# EAGLE schematic l_meter (EAGLE 9.2.2)
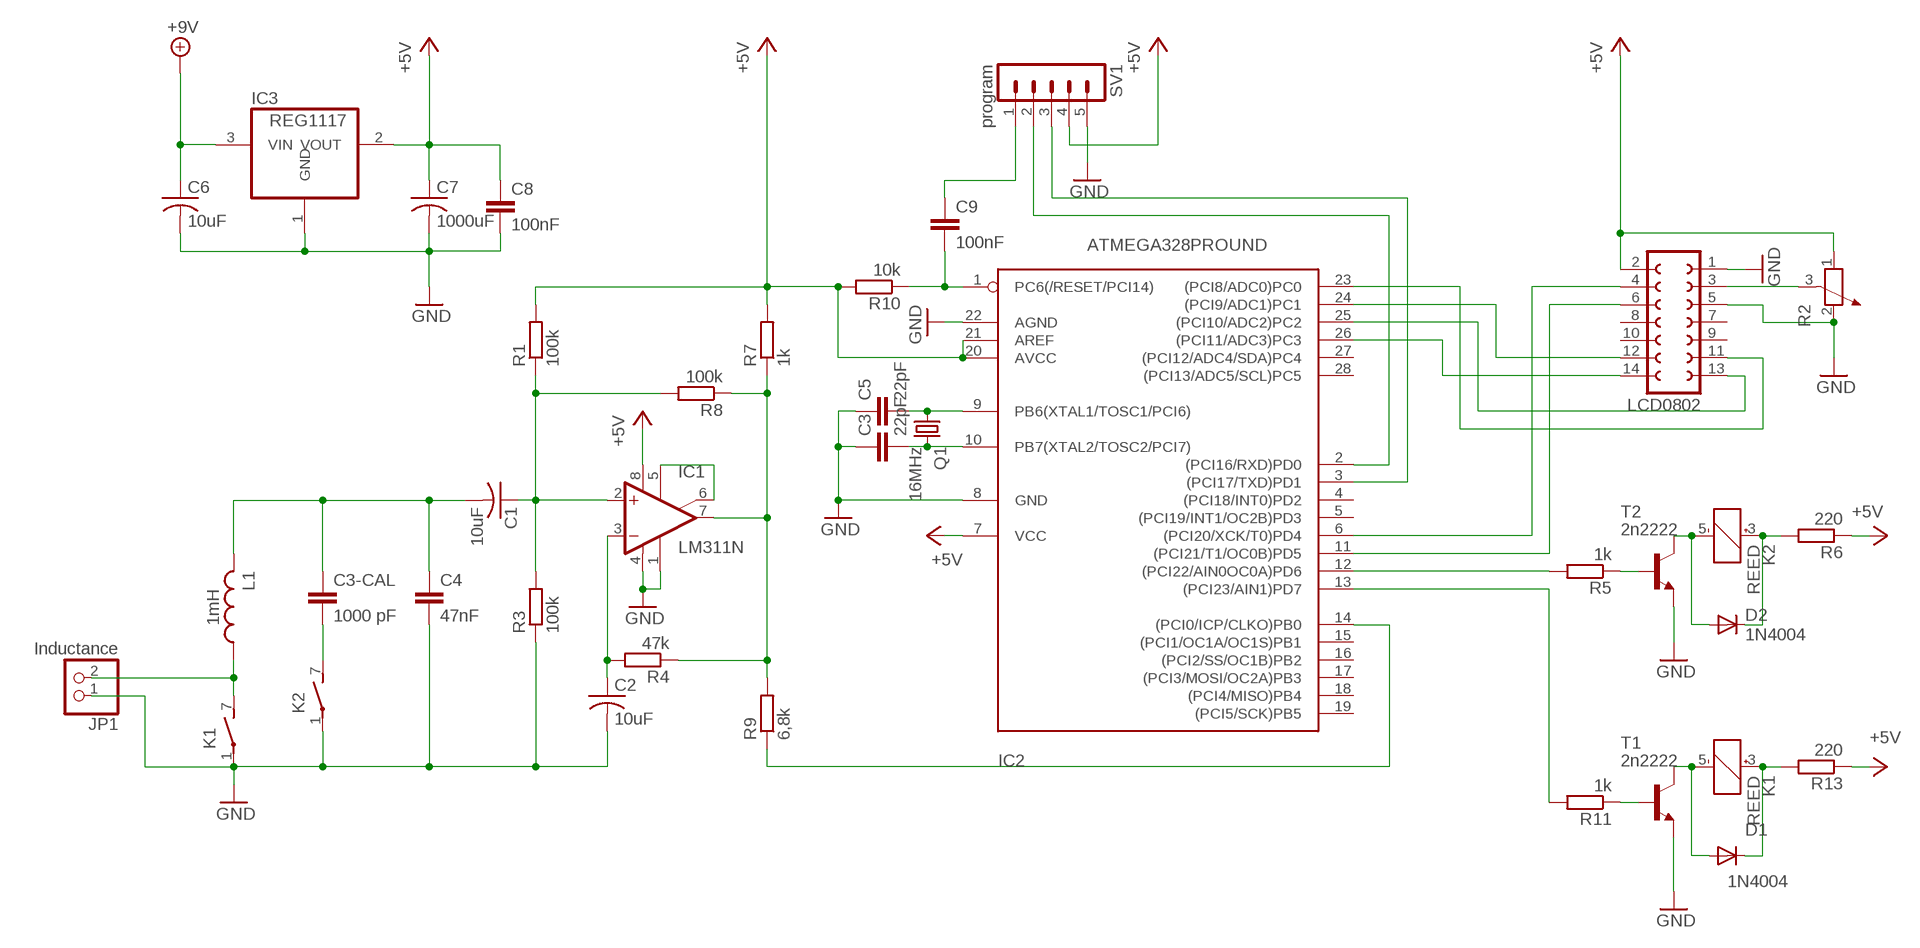
[diagram p0: schematic, sheet 1]

## Parts
C1  10uF  C-US025-024X044  [C025-024X044]
C2  10uF  C-US025-024X044  [C025-024X044]
C3  22pF  C2,5-3  [C2.5-3]
C3-CAL  1000 pF  C2,5-3  [C2.5-3]
C4  47nF  C2,5-3  [C2.5-3]
C5  22pF  C2,5-3  [C2.5-3]
C6  10uF  C-US025-024X044  [C025-024X044]
C7  1000uF  C-US025-024X044  [C025-024X044]
C8  100nF  C2,5-3  [C2.5-3]
C9  100nF  C2,5-3  [C2.5-3]
D1  1N4004  [DO41-10]
D2  1N4004  [DO41-10]
IC1  LM311N  [DIL08]
IC2  ATMEGA328PROUND  [DIL28-3-ROUND]
IC3  REG1117  [SOT223]
JP1  Inductance  PINHD-1X2  [1X02]
K1  REED  [REED]
K2  REED  [REED]
L1  1mH  INDUCTOR_0805_N  [RESC0805_N]
LCD0802  FE07-2  [FE07-2]
Q1  16MHz  CRYSTALHC18U-V  [HC18U-V]
R1  100k  R0204/7  [0204/7]
R2  POTENTIOMETER_PT_SPIN  [PT-SPIN]
R3  100k  R0204/7  [0204/7]
R4  47k  R0204/7  [0204/7]
R5  1k  R0204/7  [0204/7]
R6  220  R0204/7  [0204/7]
R7  1k  R0204/7  [0204/7]
R8  100k  R0204/7  [0204/7]
R9  6,8k  R0204/7  [0204/7]
R10  10k  R0204/7  [0204/7]
R11  1k  R0204/7  [0204/7]
R13  220  R0204/7  [0204/7]
SV1  program  MA05-1  [MA05-1]
T1  2n2222  2N2222-NPN-TO92-EBC  [TO92-EBC]
T2  2n2222  2N2222-NPN-TO92-EBC  [TO92-EBC]

## Nets
+5V: C7.1 C8.1 IC1.8(V+) IC2.7(VCC) IC2.20(AVCC) IC2.21(AREF) IC3.2(VOUT) LCD0802.2 R1.2 R2.1 R6.1 R7.2 R10.2 R13.1 SV1.4
+9V: C6.1 IC3.3(VIN)
GND: C2.2 C3.1 C4.2 C5.1 C6.2 C7.2 C8.2 IC1.1(GND) IC1.4(V-) IC2.8(GND) IC2.22(AGND) IC3.1(GND) JP1.1 K1.1(2:P) K2.1(2:P) LCD0802.1 LCD0802.5 R2.2 R3.1 SV1.5 T1.E T2.E
N$1: C1.1 IC1.2(+IN) R1.1 R3.2 R8.2
N$2: C2.1 IC1.3(-IN) R4.2
N$3: C1.2 C3-CAL.1 C4.1 L1.2
N$4: JP1.2 K1.7(2:S) L1.1
N$5: C9.2 IC2.1(PC6(/RESET/PCI14)) R10.1
N$6: IC1.5(ON) IC1.6(ON/STR)
N$7: C5.2 IC2.9(PB6(XTAL1/TOSC1/PCI6)) Q1.1
N$8: IC1.7(OUT) R4.1 R7.1 R8.1 R9.2
N$9: C3.2 IC2.10(PB7(XTAL2/TOSC2/PCI7)) Q1.2
N$10: C9.1 SV1.1
N$11: IC2.3((PCI17/TXD)PD1) SV1.3
N$12: IC2.2((PCI16/RXD)PD0) SV1.2
N$13: D1.A K1.5(1:-) T1.C
N$14: R11.1 T1.B
N$15: D1.C K1.3(1:+) R13.2
N$16: IC2.23((PCI8/ADC0)PC0) LCD0802.11
N$17: IC2.14((PCI0/ICP/CLKO)PB0) R9.1
N$18: IC2.25((PCI10/ADC2)PC2) LCD0802.13
N$19: IC2.24((PCI9/ADC1)PC1) LCD0802.12
N$20: IC2.26((PCI11/ADC3)PC3) LCD0802.14
N$21: LCD0802.3 R2.3
N$22: C3-CAL.2 K2.7(2:S)
N$23: IC2.6((PCI20/XCK/T0)PD4) LCD0802.4
N$25: IC2.12((PCI22/AIN0OC0A)PD6) R5.2
N$26: IC2.13((PCI23/AIN1)PD7) R11.2
N$27: IC2.11((PCI21/T1/OC0B)PD5) LCD0802.6
N$29: R5.1 T2.B
N$30: D2.A K2.5(1:-) T2.C
N$31: D2.C K2.3(1:+) R6.2
Unconnected: IC2.4((PCI18/INT0)PD2) IC2.5((PCI19/INT1/OC2B)PD3) IC2.15((PCI1/OC1A/OC1S)PB1) IC2.16((PCI2/SS/OC1B)PB2) IC2.17((PCI3/MOSI/OC2A)PB3) IC2.18((PCI4/MISO)PB4) IC2.19((PCI5/SCK)PB5) IC2.27((PCI12/ADC4/SDA)PC4) IC2.28((PCI13/ADC5/SCL)PC5) LCD0802.7 LCD0802.8 LCD0802.9 LCD0802.10

## Library data of the parts
C1 C2 C6 C7 = adafruit:C-US: CAPACITOR, American symbol
C3 C3-CAL C4 C5 C8 C9 = capacitor-wima:C: CAPACITOR naming: grid - package width
D1 D2 = diode:1N4004: DIODE general purpose rectifier, 1 A
IC1 = linear:LM311: COMPARATOR
IC2 = atmega328:ATMEGA328*P: MICROCONTROLLER 32 kBytes FLASH 2 kBytes SRAM 1 kBytes EEPROM USART 8-channel 10 bit ADC
IC3 = burr-brown:REG1117: 800mA and 1A Low Dropout (LDO) Positive Regulator 1.8V, 2.5V, 2.85V, 3.3V, 5V, and Adj; MPN: REG1117; OC_FARNELL: 1097566; OC_NEWARK: 14P6981
JP1 = pinhead:PINHD-1X2: PIN HEADER
K1 K2 = relay:REED: RELAY reed, 1 x norm. open with polarity, grid 5.08; OC_FARNELL: unknown; OC_NEWARK: unknown
L1 = Nordic_misc:INDUCTOR: Generic chip inductor
LCD0802 = con-lsta:FE07-2: FEMALE HEADER; OC_FARNELL: unknown; OC_NEWARK: unknown
Q1 = crystal:CRYSTAL: CRYSTAL; OC_FARNELL: unknown; OC_NEWARK: unknown
R1 R3-R11 R13 = eagle-ltspice:R: RESISTOR, European symbol; SPICEMODEL: NONE; SPICEPREFIX: R
R2 = rcl:POTENTIOMETER_: Potentiometer; SPICEMODEL: POT; SPICEPREFIX: X
SV1 = con-lstb:MA05-1: PIN HEADER; OC_FARNELL: unknown; OC_NEWARK: unknown
T1 T2 = transistor-neu-to92:*-NPN-: NPN Transistror